# EasyEDA Pro project ProPrj_cdweatherv2_2026-01-21.epro

# Schematic Schematic1
Board Name: Board1; Create Date: 2026-01-21; Page Name: P1; Project Name: cdweatherv2; Schematic Name: Schematic1; Update Date: 2026-01-21; Company: EasyEDA.com; Page Size: A4; Version: V1.0
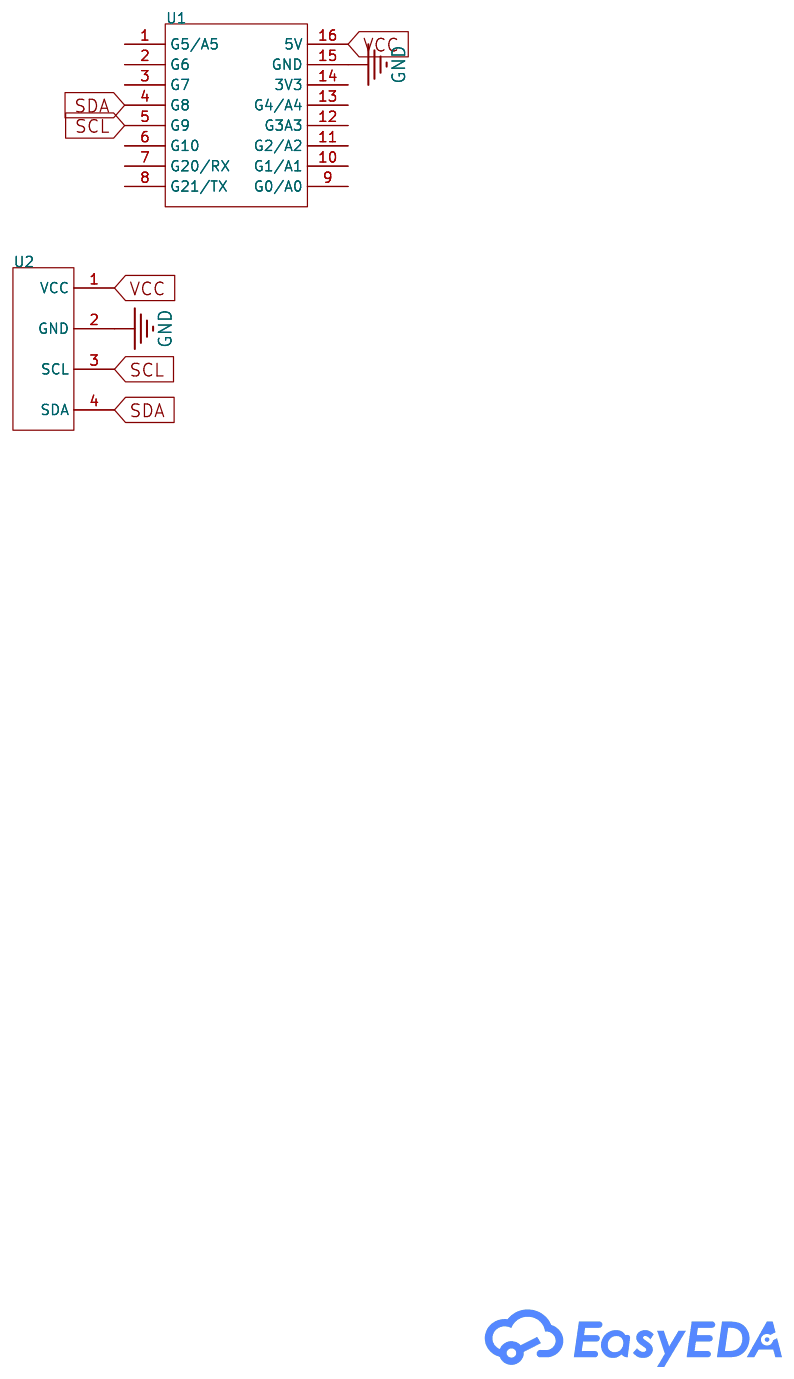
[diagram p0: schematic sheet]

## Parts
U1  -  [ESP32 C3 SUPER MINI]
U2  -  [BME280 Module - V]

## Library data of the parts
U1 = ESP32 C3 SUPER MINI
U2 = BME280 Module - V

## Nets
GND: U1.15(GND) U2.2(GND)
VCC: U1.16(5V) U2.1(VCC)
SCL: U1.5(G9) U2.3(SCL)
SDA: U1.4(G8) U2.4(SDA)

Not connected (* = marked no-connect by the designer): U1 1(G5/A5) 2(G6) 3(G7) 6(G10) 7(G20/RX) 8(G21/TX) 9(G0/A0) 10(G1/A1) 11(G2/A2) 12(G3A3) 13(G4/A4) 14(3V3)

# Board PCB1
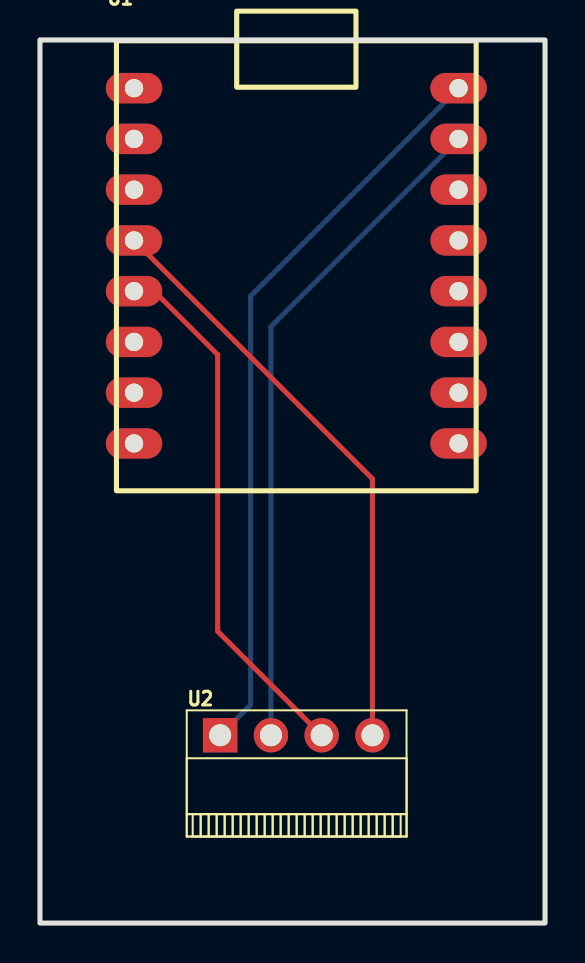
[diagram p1: board, top side]
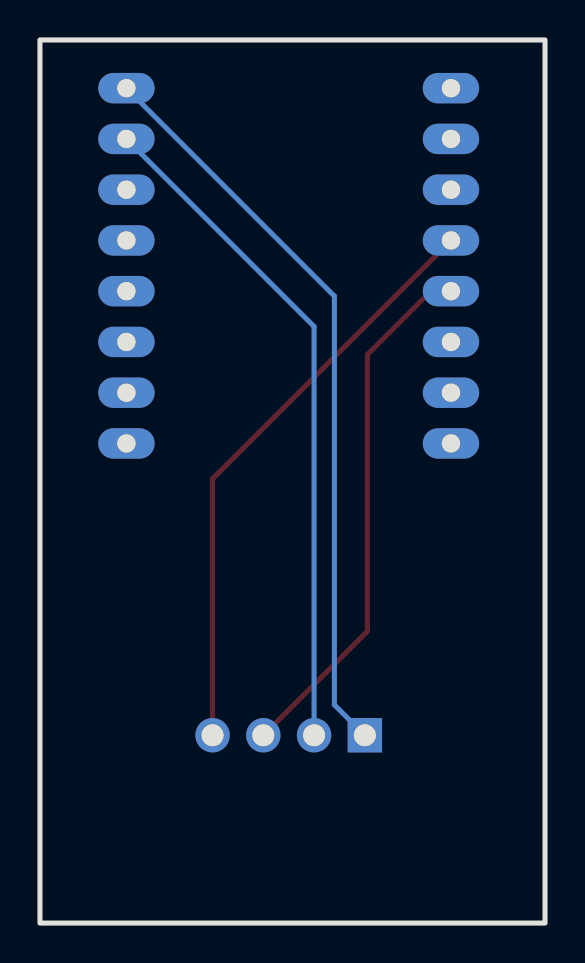
[diagram p2: board, bottom side, seen from below]

Outline 25.27 x 44.2 mm; copper layers: Top Layer, Bottom Layer. Coordinates in mm from the lower left corner of the outline.
Outline path: rectangle 0,44.2 25.27,0
Stack: Top Layer 0.035mm / Dielectric1 1.51mm FR4 er 4.5 / Bottom Layer 0.035mm

## Design rules (mm)
template: JLCPCB Capability(Two Layers Board)
spacing copperThickness1oz (default): track to track 0.102, other pairs 0.152 to 0.3
spacing copperThickness2oz: track to track 0.203, other pairs 0.152 to 0.3
track width copperThickness1oz (default): min 0.127, default 0.254, max 2.54
track width copperThickness2oz: min 0.203, default 0.254, max 2.54
differential pair differentialPair (default): width min 0.127, default 0.254, max 2.54; gap min 0.152, default 0.152
via viaSize (default): diameter min 0.5, default 0.61, max 10; hole min 0.3, default 0.305, max 6.3

## Placement (name value [footprint] x y rotation side)
U1  -  [ESP32 C3 SUPER MINI]  12.83 32.89 0 top
U2  -  [BME280 Module - V]  7.37 4.32 0 top

## Footprints (pads in the part's own frame, mm; a bottom-side part is the same pattern mirrored in y, then rotated)
BME280 Module - V
  rect 1.724x1.724 hole 1.1: 1(1.651,5.08)
  round 1.724 hole 1.1: 2(4.191,5.08) 3(6.731,5.08) 4(9.271,5.08)
ESP32 C3 SUPER MINI
  oval 2.824x1.524 hole 0.914: 1(-8.12,8.89) 2(-8.12,6.35) 3(-8.12,3.81) 4(-8.12,1.27) 5(-8.12,-1.27) 6(-8.12,-3.81) 7(-8.12,-6.35) 8(-8.12,-8.89) 9(8.12,-8.89) 10(8.12,-6.35) 11(8.12,-3.81) 12(8.12,-1.27) 13(8.12,1.27) 14(8.12,3.81) 15(8.12,6.35) 16(8.12,8.89)

## Nets
As in the schematic.

Pads without a net: U1 1 2 3 6 7 8 9 10 11 12 13 14

## Routing (per net, layer and track width the routed paths; a pad name or vN(x,y) marks a point on that pad's centre or on a via; arc(x,y) is an arc through that point)
GND: length 33.7
  Bottom Layer w0.254: U2.2 11.56,29.85 U1.15
VCC: length 37.3
  Bottom Layer w0.254: U1.16 10.54,31.38 10.54,10.92 U2.1
SCL: length 26.7
  Top Layer w0.254: U2.3 8.89,14.61 8.89,28.45 5.72,31.62 U1.5
SDA: length 29.7
  Top Layer w0.254: U1.4 16.64,22.23 U2.4
